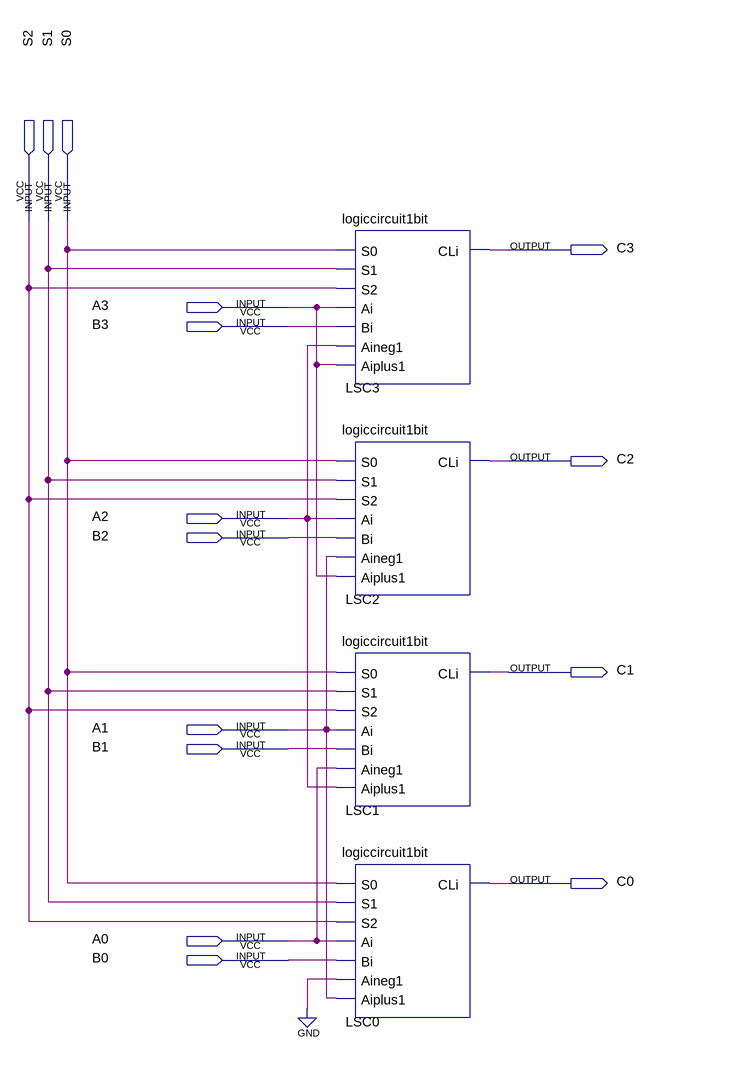
[diagram p0: schematic sheet]
// Quartus schematic logiccircuit4bit.bdf as structural Verilog: 4 symbols, 15 pins
module logiccircuit4bit (
  input  S2,
  input  S1,
  input  S0,
  input  A3,
  input  B3,
  input  A2,
  input  B2,
  input  A1,
  input  B1,
  input  A0,
  input  B0,
  output C3,
  output C2,
  output C1,
  output C0
);

  logiccircuit1bit LSC3 (.S0(S0), .S1(S1), .S2(S2), .Ai(A3), .Bi(B3), .Aineg1(A2), .Aiplus1(A3), .CLi(C3));
  logiccircuit1bit LSC2 (.S0(S0), .S1(S1), .S2(S2), .Ai(A2), .Bi(B2), .Aineg1(A1), .Aiplus1(A3), .CLi(C2));
  logiccircuit1bit LSC1 (.S0(S0), .S1(S1), .S2(S2), .Ai(A1), .Bi(B1), .Aineg1(A0), .Aiplus1(A2), .CLi(C1));
  logiccircuit1bit LSC0 (.S0(S0), .S1(S1), .S2(S2), .Ai(A0), .Bi(B0), .Aineg1(1'b0), .Aiplus1(A1), .CLi(C0));
endmodule
